# Altium schematic sheet TDisplay.SchDoc: LiveDesign Evaluation - EvalBoard Tester
size A4; Organization: Altium Limited; Address1: L3, 12a Rodborough Rd; Address2: Frenchs Forest; Address3: NSW; Address4: Australia 2086; DocumentNumber: 7; SheetNumber: 7; SheetTotal: 16
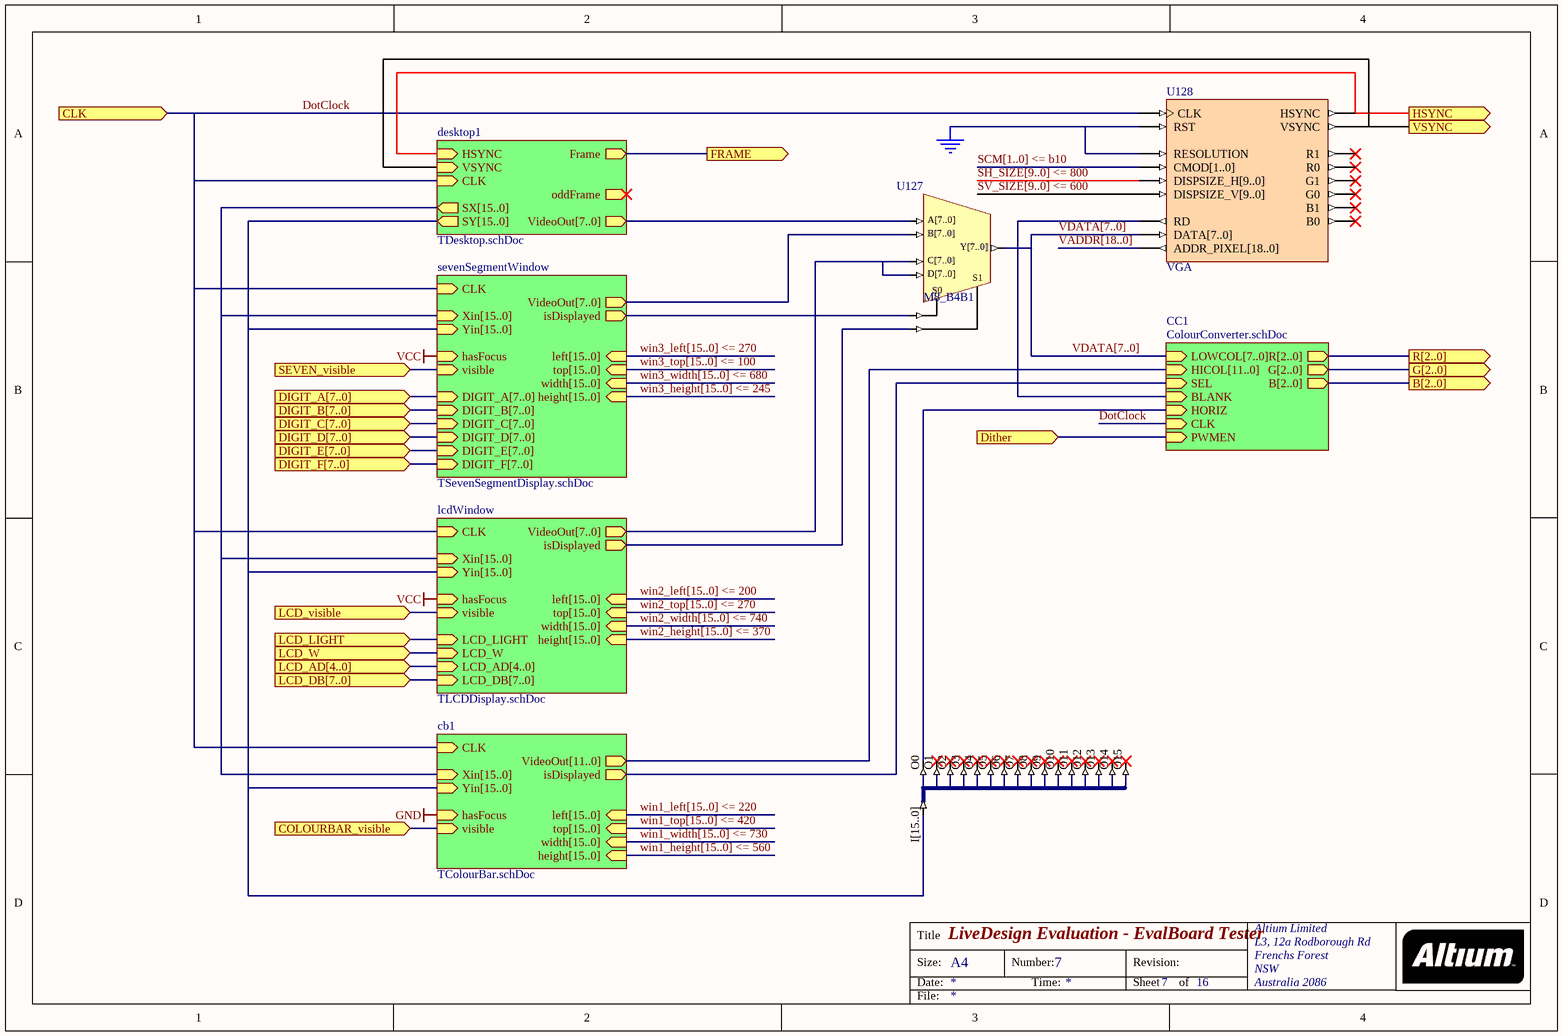
[diagram p0: TDisplay.SchDoc]

## Parts
U127  M8_B4B1
U128  VGA
U129  J16B_16S  (value not drawn)

## Sub-sheets
cb1 = TColourBar.schDoc: CLK (in), VideoOut[11..0] (out), Xin[15..0] (in), Yin[15..0] (in), top[15..0] (in), width[15..0] (in), height[15..0] (in), left[15..0] (in), isDisplayed (out), hasFocus (in), visible (in)
CC1 = ColourConverter.schDoc: R[2..0] (out), G[2..0] (out), B[2..0] (out), LOWCOL[7..0] (in), HICOL[11..0] (in), SEL (in), CLK (in), BLANK (in), HORIZ (in), PWMEN (in)
desktop1 = TDesktop.schDoc: CLK (in), VideoOut[7..0] (out), SX[15..0] (out), SY[15..0] (out), HSYNC (in), VSYNC (in), Frame (out), oddFrame (out)
lcdWindow = TLCDDisplay.schDoc: CLK (in), VideoOut[7..0] (out), Xin[15..0] (in), Yin[15..0] (in), top[15..0] (in), width[15..0] (in), height[15..0] (in), left[15..0] (in), isDisplayed (out), hasFocus (in), LCD_LIGHT (in), LCD_W (in), LCD_AD[4..0] (in), LCD_DB[7..0] (in), visible (in)
sevenSegmentWindow = TSevenSegmentDisplay.schDoc: CLK (in), VideoOut[7..0] (out), Xin[15..0] (in), Yin[15..0] (in), top[15..0] (in), width[15..0] (in), height[15..0] (in), left[15..0] (in), DIGIT_A[7..0] (in), isDisplayed (out), hasFocus (in), DIGIT_B[7..0] (in), DIGIT_C[7..0] (in), DIGIT_D[7..0] (in), DIGIT_E[7..0] (in), DIGIT_F[7..0] (in), visible (in)

## Ports
B[2..0] (out), CLK (in), COLOURBAR_visible (in), DIGIT_A[7..0] (in), DIGIT_B[7..0] (in), DIGIT_C[7..0] (in), DIGIT_D[7..0] (in), DIGIT_E[7..0] (in), DIGIT_F[7..0] (in), Dither (in), FRAME (out), G[2..0] (out), HSYNC (out), LCD_AD[4..0] (in), LCD_DB[7..0] (in), LCD_LIGHT (in), LCD_visible (in), LCD_W (in), R[2..0] (out), SEVEN_visible (in), VSYNC (out)

## Nets
GND: U128.RESOLUTION U128.RST ; sheet cb1/hasFocus
VCC: sheet sevenSegmentWindow/hasFocus, sheet lcdWindow/hasFocus
COLOURBAR_visible: port COLOURBAR_visible, sheet cb1/visible
Dither: port Dither, sheet CC1/PWMEN
DotClock: U128.CLK ; port CLK, sheet sevenSegmentWindow/CLK, sheet desktop1/CLK, sheet lcdWindow/CLK, sheet cb1/CLK, sheet CC1/CLK
FRAME: port FRAME, sheet desktop1/Frame
HSYNC: U128.HSYNC ; port HSYNC, sheet desktop1/HSYNC
LCD_LIGHT: port LCD_LIGHT, sheet lcdWindow/LCD_LIGHT
LCD_visible: port LCD_visible, sheet lcdWindow/visible
LCD_W: port LCD_W, sheet lcdWindow/LCD_W
SCM[1..0] <= b10: U128.CMOD[1..0]
SEVEN_visible: port SEVEN_visible, sheet sevenSegmentWindow/visible
SH_SIZE[9..0] <= 800: U128.DISPSIZE_H[9..0]
SV_SIZE[9..0] <= 600: U128.DISPSIZE_V[9..0]
VADDR[18..0]: U128.ADDR_PIXEL[18..0]
VDATA[7..0]: U127.Y[7..0] U128.DATA[7..0] ; sheet CC1/LOWCOL[7..0]
VSYNC: U128.VSYNC ; port VSYNC, sheet desktop1/VSYNC
NetU127_A[7..0]: U127.A[7..0] ; sheet desktop1/VideoOut[7..0]
NetU127_B[7..0]: U127.B[7..0] ; sheet sevenSegmentWindow/VideoOut[7..0]
NetU127_C[7..0]: U127.C[7..0] U127.D[7..0] ; sheet lcdWindow/VideoOut[7..0]
NetU127_S0: U127.S0 ; sheet sevenSegmentWindow/isDisplayed
NetU127_S1: U127.S1 ; sheet lcdWindow/isDisplayed
NetU128_RD: U128.RD ; sheet CC1/BLANK
NetU129_I[15..0]: U129.I[15..0] ; sheet sevenSegmentWindow/Yin[15..0], sheet desktop1/SY[15..0], sheet lcdWindow/Yin[15..0], sheet cb1/Yin[15..0]
NetU129_O0: U129.O0 ; sheet CC1/HORIZ
(unnamed): sheet cb1/isDisplayed, sheet CC1/SEL

Not connected (* = marked no-connect by the designer): U128 B0* B1* G0* G1* R0* R1*; U129 O1* O2* O3* O4* O5* O6* O7* O8* O9* O10* O11* O12* O13* O14* O15*

## Buses and harness runs
bus port B[2..0] = sheet CC1/B[2..0]
bus port DIGIT_A[7..0] = sheet sevenSegmentWindow/DIGIT_A[7..0]
bus port DIGIT_B[7..0] = sheet sevenSegmentWindow/DIGIT_B[7..0]
bus port DIGIT_C[7..0] = sheet sevenSegmentWindow/DIGIT_C[7..0]
bus port DIGIT_D[7..0] = sheet sevenSegmentWindow/DIGIT_D[7..0]
bus port DIGIT_E[7..0] = sheet sevenSegmentWindow/DIGIT_E[7..0]
bus port DIGIT_F[7..0] = sheet sevenSegmentWindow/DIGIT_F[7..0]
bus port G[2..0] = sheet CC1/G[2..0]
bus port LCD_AD[4..0] = sheet lcdWindow/LCD_AD[4..0]
bus port LCD_DB[7..0] = sheet lcdWindow/LCD_DB[7..0]
bus port R[2..0] = sheet CC1/R[2..0]
bus SCM[1..0] <= b10
bus SH_SIZE[9..0] <= 800
bus sheet cb1/VideoOut[11..0] = sheet CC1/HICOL[11..0]
bus sheet cb1/Xin[15..0] = sheet desktop1/SX[15..0] = sheet lcdWindow/Xin[15..0] = sheet sevenSegmentWindow/Xin[15..0]
bus sheet cb1/Yin[15..0] = sheet desktop1/SY[15..0] = sheet lcdWindow/Yin[15..0] = sheet sevenSegmentWindow/Yin[15..0]
bus SV_SIZE[9..0] <= 600
bus VADDR[18..0]
bus VDATA[7..0] = sheet CC1/LOWCOL[7..0]
bus win1_height[15..0] <= 560 = sheet cb1/height[15..0]
bus win1_left[15..0] <= 220 = sheet cb1/left[15..0]
bus win1_top[15..0] <= 420 = sheet cb1/top[15..0]
bus win1_width[15..0] <= 730 = sheet cb1/width[15..0]
bus win2_height[15..0] <= 370 = sheet lcdWindow/height[15..0]
bus win2_left[15..0] <= 200 = sheet lcdWindow/left[15..0]
bus win2_top[15..0] <= 270 = sheet lcdWindow/top[15..0]
bus win2_width[15..0] <= 740 = sheet lcdWindow/width[15..0]
bus win3_height[15..0] <= 245 = sheet sevenSegmentWindow/height[15..0]
bus win3_left[15..0] <= 270 = sheet sevenSegmentWindow/left[15..0]
bus win3_top[15..0] <= 100 = sheet sevenSegmentWindow/top[15..0]
bus win3_width[15..0] <= 680 = sheet sevenSegmentWindow/width[15..0]

## Notes on the sheet
- Title
- Size:
- Date:
- A4
- Number:
- Time:
- Revision:
- Sheet
- of
- File:

## Library data of the parts
U127 = M8_B4B1: 4x8-Bit Bus to 1x8-Bit Bus Multiplexer; ArchiveName: GENERIC; VHDLIB_SIM: GENERIC_LIB; Published: 29-Jan-2004; Publisher: Altium Limited; Core Revision: 1.00.00
U128 = VGA: VGA Controller; Published: 18/12/2003; Publisher: Altium Hobart Technology Centre; Core Revision: 1.00.00
U129 = J16B_16S: Single 16-Bit input bus to 16 single pin outputs; ArchiveName: GENERIC; VHDLIB_SIM: GENERIC_LIB; Published: 29-Jan-2004; Publisher: Altium Limited; Core Revision: 1.00.00